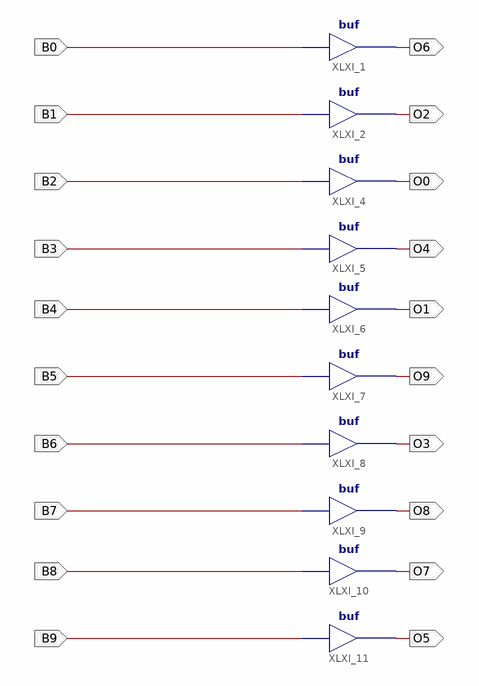
[diagram p0: schematic sheet 1]
// Xilinx ISE schematic P10.sch (xc9500xl) as structural Verilog: 10 symbols, 20 ports
module P10 (
  input  B0,
  input  B1,
  input  B2,
  input  B3,
  input  B4,
  input  B5,
  input  B6,
  input  B7,
  input  B8,
  input  B9,
  output O6,
  output O2,
  output O0,
  output O4,
  output O1,
  output O9,
  output O3,
  output O8,
  output O7,
  output O5
);

  buf XLXI_1 (O6, B0);
  buf XLXI_2 (O2, B1);
  buf XLXI_4 (O0, B2);
  buf XLXI_5 (O4, B3);
  buf XLXI_6 (O1, B4);
  buf XLXI_7 (O9, B5);
  buf XLXI_8 (O3, B6);
  buf XLXI_9 (O8, B7);
  buf XLXI_10 (O7, B8);
  buf XLXI_11 (O5, B9);
endmodule
